# EAGLE design anvil_mainFinal (EAGLE 7.5.0)
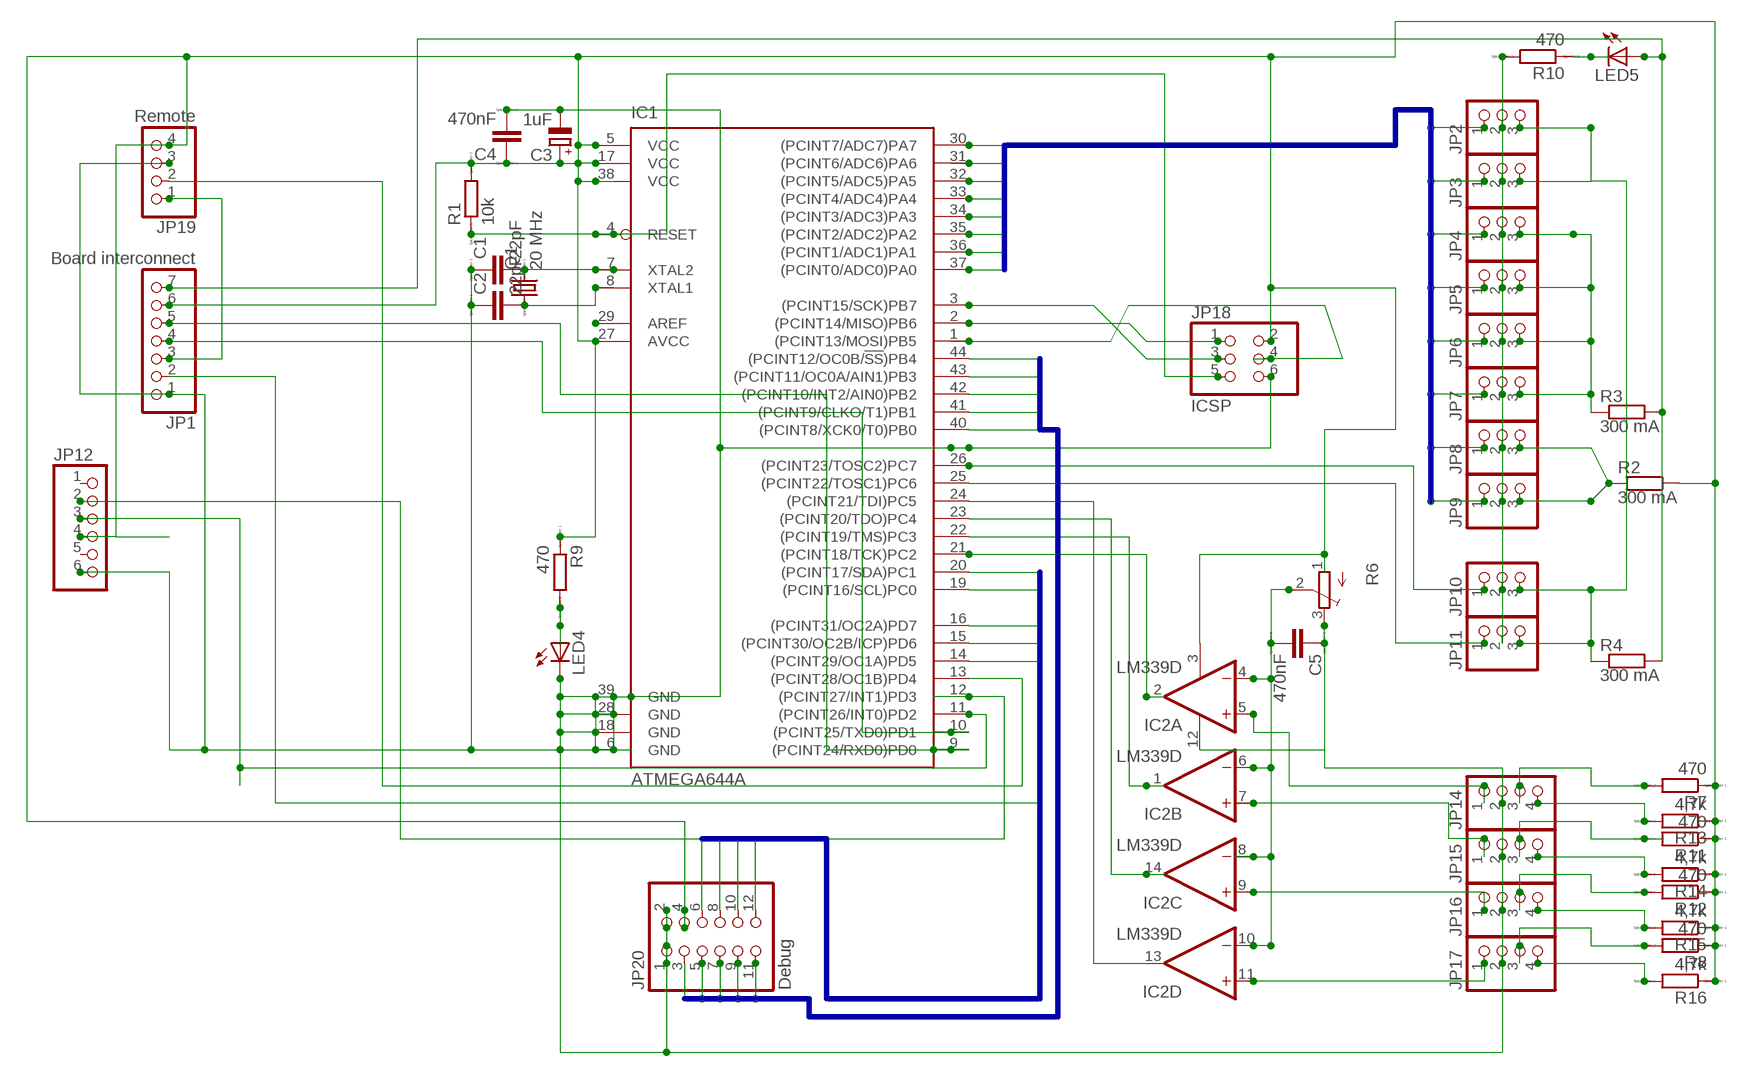
[diagram p0: schematic, sheet 1]

## Parts
C1  22pF  CC1206  [C1206]
C2  22pF  CC1206  [C1206]
C3  1uF  CPOL-EU153CLV-0505  [153CLV-0505]
C4  470nF  CC1206  [C1206]
C5  470nF  CC1206  [C1206]
IC1  ATMEGA644A  [TQFP44]
IC2  LM339D  [SO14]
JP1  Board interconnect  PINHD-1X7_2.54  [1X07]
JP2  PINHD-1X3_2.54-SMD  [1X03SMD]
JP3  PINHD-1X3_2.54-SMD  [1X03SMD]
JP4  PINHD-1X3_2.54-SMD  [1X03SMD]
JP5  PINHD-1X3_2.54-SMD  [1X03SMD]
JP6  PINHD-1X3_2.54-SMD  [1X03SMD]
JP7  PINHD-1X3_2.54-SMD  [1X03SMD]
JP8  PINHD-1X3_2.54-SMD  [1X03SMD]
JP9  PINHD-1X3_2.54-SMD  [1X03SMD]
JP10  PINHD-1X3_2.54-SMD  [1X03SMD]
JP11  PINHD-1X3_2.54-SMD  [1X03SMD]
JP12  PINHD-1X61X06_SMT  [1X06_SMT]
JP14  PINHD-1X4_2.54-SMD  [1X04SMD]
JP15  PINHD-1X4_2.54-SMD  [1X04SMD]
JP16  PINHD-1X4_2.54-SMD  [1X04SMD]
JP17  PINHD-1X4_2.54-SMD  [1X04SMD]
JP18  ICSP  PINHD-2X3_2.54-SMD  [2X03SMD]
JP19  Remote  PINHD-1X4_2.54-SMD  [1X04SMD]
JP20  Debug  PINHD-2X6_2.54-SMD  [2X06SMD]
LED4  LEDSMT1206  [1206]
LED5  LEDSMT1206  [1206]
Q1  20 MHz  CSM-7X-DU  [CSM-7X-DU]
R1  10k  RR1206  [R1206]
R2  300 mA  SMS-REF  [SMS-REF]
R3  300 mA  SMS-REF  [SMS-REF]
R4  300 mA  SMS-REF  [SMS-REF]
R6  TRIM_EU-SM-42/43B  [SM-42/43B]
R7  470  RR1206  [R1206]
R8  470  RR1206  [R1206]
R9  470  RR1206  [R1206]
R10  470  RR1206  [R1206]
R11  470  RR1206  [R1206]
R12  470  RR1206  [R1206]
R13  4,7k  RR1206  [R1206]
R14  4,7k  RR1206  [R1206]
R15  4,7k  RR1206  [R1206]
R16  4,7k  RR1206  [R1206]

## Nets
DBG0: IC1.20((PCINT17/SDA)PC1) JP20.12
DBG1: IC1.19((PCINT16/SCL)PC0) JP20.10
DBG2: IC1.16((PCINT31/OC2A)PD7) JP20.8
DBG3: IC1.15((PCINT30/OC2B/ICP)PD6) JP20.6
DBG4: IC1.44((PCINT12/OC0B/!SS!)PB4) JP20.3
DBG5: IC1.43((PCINT11/OC0A/AIN1)PB3) JP20.5
DBG6: IC1.42((PCINT10/INT2/AIN0)PB2) JP20.7
DBG7: IC1.41((PCINT9/CLKO/T1)PB1) JP20.9
DBG8: IC1.40((PCINT8/XCK0/T0)PB0) JP20.11
GND: C1.1 C2.1 C3.- C4.2 C5.1 IC1.6(GND) IC1.18(GND) IC1.28(GND) IC1.39(GND) IC2.12(P:GND) JP1.1 JP2.2 JP3.2 JP4.2 JP5.2 JP6.2 JP7.2 JP8.2 JP9.2 JP10.2 JP11.2 JP12.6 JP14.2 JP15.2 JP16.2 JP17.2 JP18.6 JP19.3 JP20.1 JP20.2 LED4.C R6.3(E) R10.2
N$1: IC1.11((PCINT26/INT0)PD2) JP12.3
N$2: IC2.11(D:+IN) JP17.1
N$3: C1.2 IC1.7(XTAL2) Q1.2
N$4: C2.2 IC1.8(XTAL1) Q1.1
N$5: JP14.3 R7.2
N$6: IC1.4(RESET) JP18.5 R1.1
N$7: IC2.9(C:+IN) JP16.1
N$8: IC1.24((PCINT21/TDI)PC5) IC2.13(D:OUT)
N$9: IC1.13((PCINT28/OC1B)PD4) JP19.2
N$10: IC1.21((PCINT18/TCK)PC2) IC2.2(A:OUT)
N$11: IC1.12((PCINT27/INT1)PD3) JP12.2
N$13: IC1.22((PCINT19/TMS)PC3) IC2.1(B:OUT)
N$14: IC1.14((PCINT29/OC1A)PD5) JP1.2
N$15: JP8.3 JP9.3 R2.2
N$16: JP1.7 LED5.A R3.1 R4.1
N$23: IC2.7(B:+IN) JP15.1
N$24: IC1.3((PCINT15/SCK)PB7) JP18.3
N$25: IC1.2((PCINT14/MISO)PB6) JP18.1
N$26: IC1.1((PCINT13/MOSI)PB5) JP18.4
N$27: IC2.5(A:+IN) JP14.1
N$28: C5.2 IC2.4(A:-IN) IC2.6(B:-IN) IC2.8(C:-IN) IC2.10(D:-IN) R6.2(S)
N$29: JP14.4 R13.2
N$30: JP15.3 R11.2
N$32: IC1.26((PCINT23/TOSC2)PC7) JP10.1
N$33: IC1.25((PCINT22/TOSC1)PC6) JP11.1
N$35: IC1.23((PCINT20/TDO)PC4) IC2.14(C:OUT)
N$39: JP15.4 R14.2
N$40: JP4.3 JP5.3 JP6.3 JP7.3 R3.2
N$42: JP2.3 JP3.3 JP10.3 JP11.3 R4.2
N$44: C3.+ C4.1 IC1.5(VCC) IC1.17(VCC) IC1.27(AVCC) IC1.38(VCC) IC2.3(P:V+) JP1.6 JP12.4 JP18.2 JP19.4 JP20.4 R1.2 R2.1 R6.1(A) R7.1 R8.1 R9.1 R11.1 R12.1 R13.1 R14.1 R15.1 R16.1
N$45: JP16.3 R12.2
N$46: JP16.4 R15.2
N$47: IC1.10((PCINT25/TXD0)PD1) JP1.4
N$48: IC1.9((PCINT24/RXD0)PD0) JP1.5
N$50: JP17.3 R8.2
N$51: JP17.4 R16.2
N$54: JP1.3 JP19.1
N$56: LED4.A R9.2
N$57: LED5.C R10.1
N$76: IC1.29(AREF)
SNS0: IC1.30((PCINT7/ADC7)PA7) JP2.1
SNS1: IC1.31((PCINT6/ADC6)PA6) JP3.1
SNS2: IC1.32((PCINT5/ADC5)PA5) JP4.1
SNS3: IC1.33((PCINT4/ADC4)PA4) JP5.1
SNS4: IC1.34((PCINT3/ADC3)PA3) JP6.1
SNS5: IC1.35((PCINT2/ADC2)PA2) JP7.1
SNS6: IC1.36((PCINT1/ADC1)PA1) JP8.1
SNS7: IC1.37((PCINT0/ADC0)PA0) JP9.1
Unconnected: JP12.1 JP12.5

## Buses
DBG[0..3]
DBG[4..9]
DBG[4..8]
SNS[0..7]
DBG[0..4]

## Library data of the parts
C1 C2 C4 C5 = eagle-ltspice:C: CAPACITOR, European symbol; SPICEMODEL: NONE; SPICEPREFIX: C
C3 = resistor:CPOL-EU: POLARIZED CAPACITOR, European symbol
IC1 = atmel:ATMEGA644: 8-bit Microcontroller with 64K Bytes In-System Programmable Flash Source: http://www.atmel.com/dyn/resources/prod_documents/doc2593.pdf; MPN: ATMEGA644PV-10AU; OC_FARNELL: 1455123; OC_NEWARK: 58M3748
IC2 = linear:LM339: Low Power Low Offset Voltage Quad Comparators with open collector; LM139/LM239/LM339/LM2901/LM3302
JP1 = pinhead:PINHD-1X7: PIN HEADER
JP2-JP11 = pinhead:PINHD-1X3: PIN HEADER
JP12 = pinhead+:PINHD-1X6: PIN HEADER
JP14-JP17 JP19 = pinhead:PINHD-1X4: PIN HEADER
JP18 = pinhead:PINHD-2X3: PIN HEADER
JP20 = pinhead:PINHD-2X6: PIN HEADER
LED4 LED5 = led:LED: LED OSRAM: - CHIPLED LG R971, LG N971, LY N971, LG Q971, LY Q971, LO R971, LY R971 LH N974, LH R974 LS Q976, LO Q976, LY Q976 LO Q996 - Hyper CHIPLED LW Q18S LB Q993, LB Q99A, LB R99A - SideLED LS A670, LO A670, LY A670, LG A670, LP A670 LB A673, LV A673, LT A673, LW A673 LH A674 LY A675 LS A676, LA A676, LO A676, LY A676, LW A676 LS A679, LY A679, LG A679 - Hyper Micro SIDELED® LS Y876, LA Y876, LO Y876, LY Y876 LT Y87S - SmartLED LW L88C, LW L88S LB L89C, LB L89S, LG L890 LS L89K, LO L89K, LY L89K LS L896, LA L896, LO L896, LY L896 - TOPLED LS T670, LO T670, LY T670, LG T670, LP T670 LSG T670, LSP T670, LSY T670, LOP T670, LYG T670 LG T671, LOG T671, LSG T671 LB T673, LV T673, LT T673, LW T673 LH T674 LS T676, LA T676, LO T676, LY T676, LB T676, LH T676, LSB T676, LW T676 LB T67C, LV T67C, LT T67C, LS T67K, LO T67K, LY T67K, LW E67C LS E67B, LA E67B, LO E67B, LY E67B, LB E67C, LV E67C, LT E67C LW T67C LS T679, LY T679, LG T679 LS T770, LO T770, LY T770, LG T770, LP T770 LB T773, LV T773, LT T773, LW T773 LH T774 LS E675, LA E675, LY E675, LS T675 LS T776, LA T776, LO T776, LY T776, LB T776 LHGB T686 LT T68C, LB T68C - Hyper Mini TOPLED® LB M676 - Mini TOPLED Santana® LG M470 LS M47K, LO M47K, LY M47K Source: http://www.osram.convergy.de LUXEON: - LUMILED® LXK2-PW12-R00, LXK2-PW12-S00, LXK2-PW14-U00, LXK2-PW14-V00 LXK2-PM12-R00, LXK2-PM12-S00, LXK2-PM14-U00 LXK2-PE12-Q00, LXK2-PE12-R00, LXK2-PE12-S00, LXK2-PE14-T00, LXK2-PE14-U00 LXK2-PB12-K00, LXK2-PB12-L00, LXK2-PB12-M00, LXK2-PB14-N00, LXK2-PB14-P00, LXK2-PB14-Q00 LXK2-PR12-L00, LXK2-PR12-M00, LXK2-PR14-Q00, LXK2-PR14-R00 LXK2-PD12-Q00, LXK2-PD12-R00, LXK2-PD12-S00 LXK2-PH12-R00, LXK2-PH12-S00 LXK2-PL12-P00, LXK2-PL12-Q00, LXK2-PL12-R00 Source: www.luxeon.com KINGBRIGHT: KA-3528ASYC Source: www.kingbright.com
Q1 = crystal:CSM-7X-DU: SMD CRYSTAL Source: www.ecsxtal.com .. Crystal 3.6864MHz CSM_7X_DU.PDF; OC_FARNELL: unknown; OC_NEWARK: unknown
R1 R7-R16 = eagle-ltspice:R: RESISTOR, European symbol; SPICEMODEL: NONE; SPICEPREFIX: R
R2-R4 = resistor-shunt:SMS-REF: SMD SHUNT RESISTOR; OC_FARNELL: unknown; OC_NEWARK: unknown
R6 = pot:TRIM_EU-: POTENTIOMETER

## Board
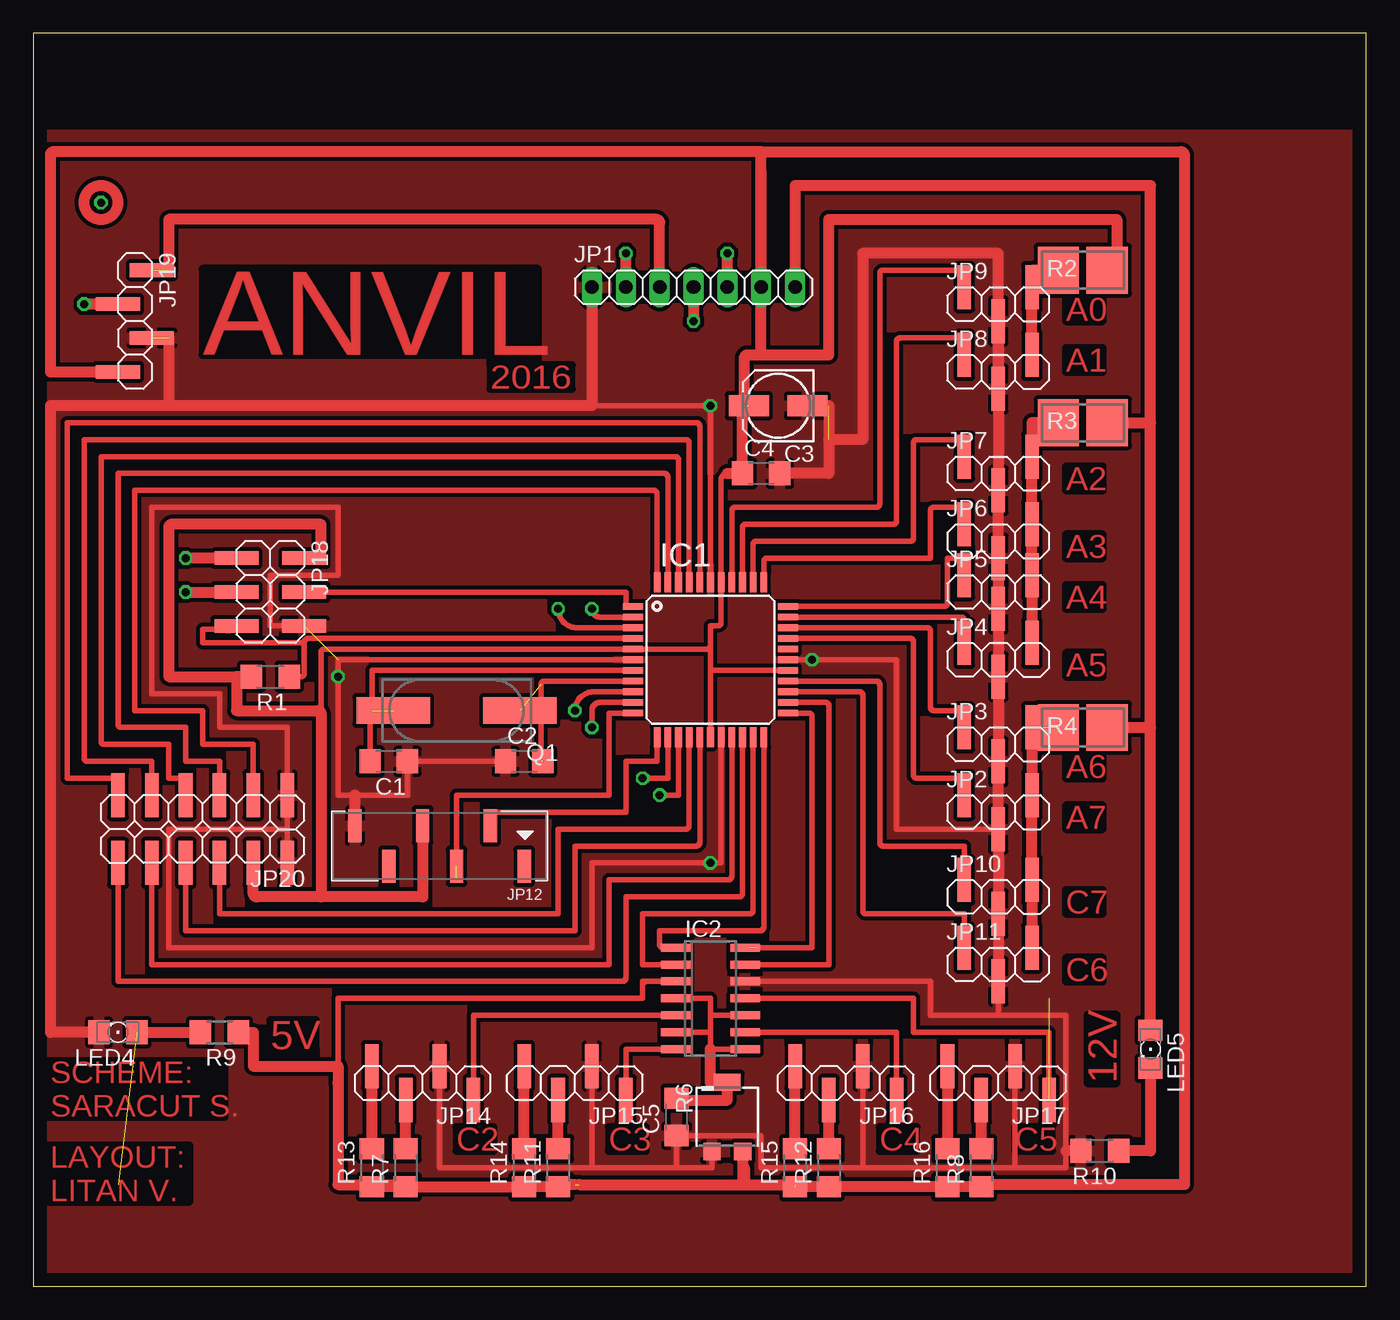
[diagram p1: board, top side]
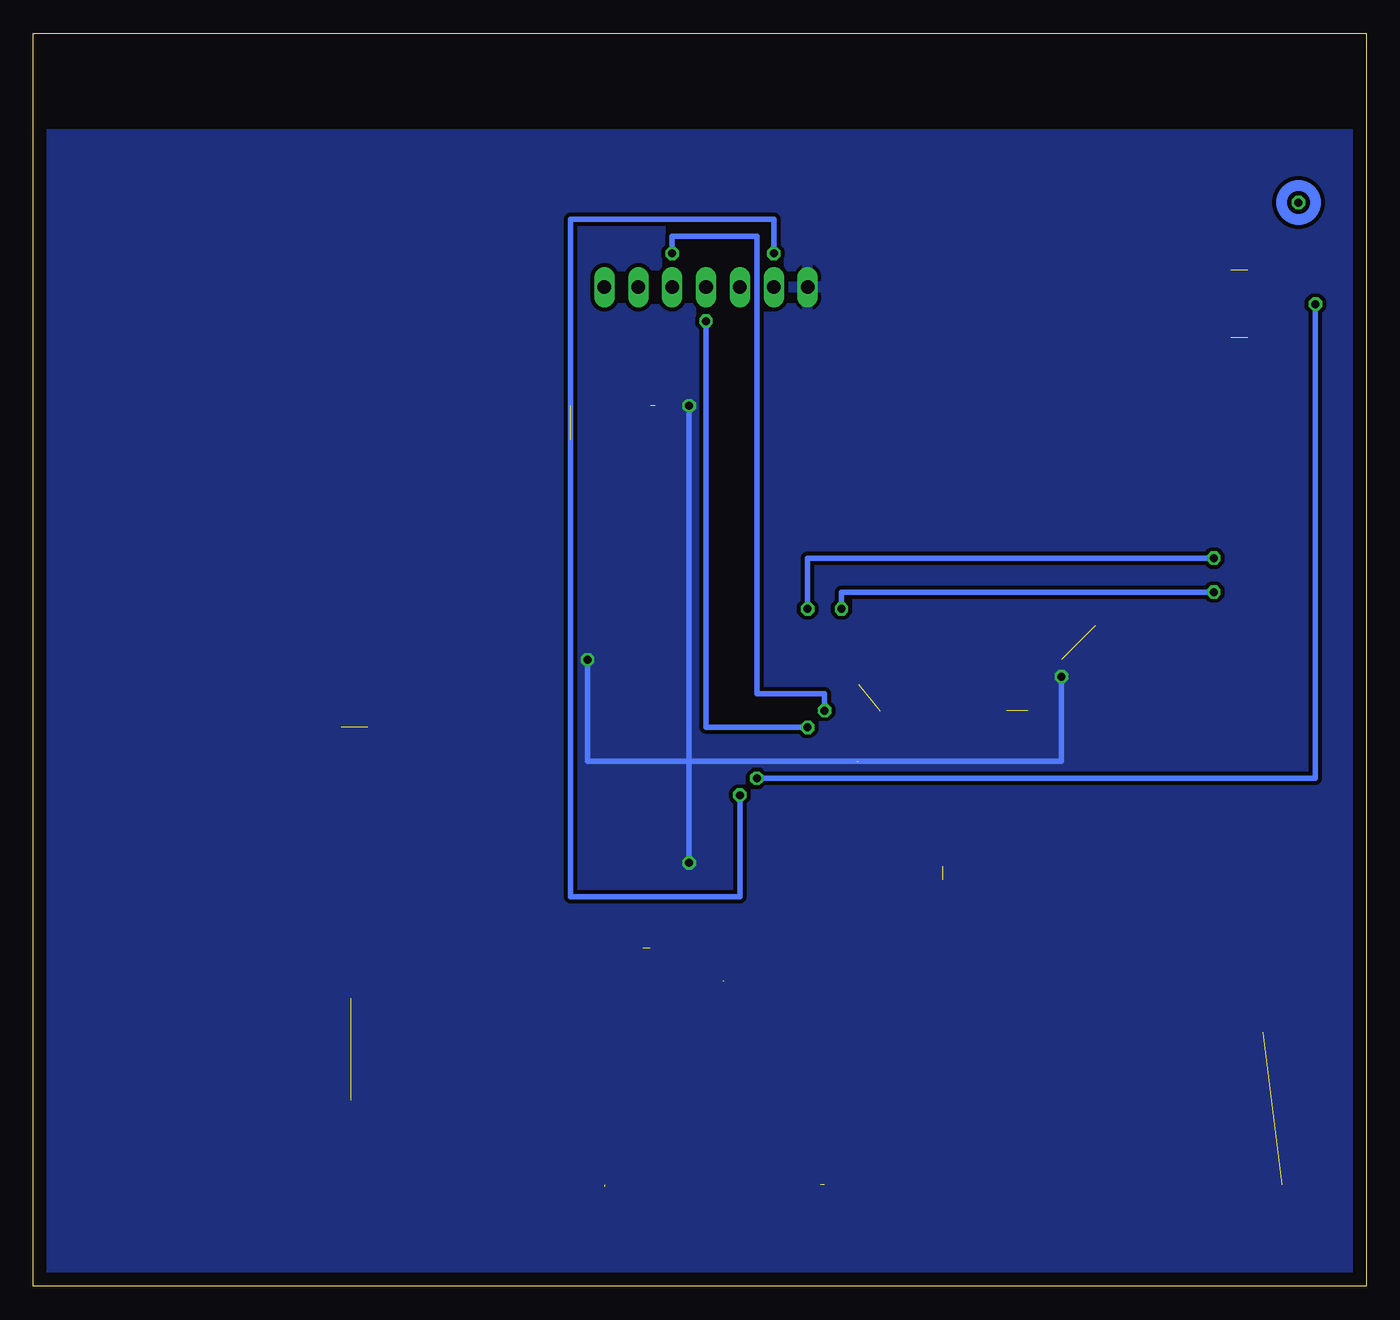
[diagram p2: board, bottom side, seen from below]

Size 100 x 93.97 mm. Coordinates in mm from the lower left corner, seen from the top.
Outline: 0,0 100,0 100,93.97 0,93.97 0,0
Copper layers (1*16): Top 0.035mm / dielectric 1.5mm / Bottom 0.035mm
Design rules "default *": minimum track width 10mil, minimum drill 24mil, track to track 12mil, track to pad 12mil, pad to pad 12mil, via to via 12mil, smd to smd 12mil, copper to edge 40mil, drill to drill 8mil, minimum pad ring 10mil, minimum via ring 8mil, stop-mask expansion 4mil, vias tented up to drill 0mil, thermal gap 10mil

### Footprints (pad centres in the part's own frame; a part is rotated, then mirrored left to right if it is on the bottom)
C1206 = smd 1.6 x 1.8: 1 -1.4,0; 2 1.4,0
153CLV-0505 = smd 3 x 1.6: + 2.2,0; - -2.2,0
TQFP44 = smd 1.5 x 0.5: 1 -5.8,4; 2 -5.8,3.2; 3 -5.8,2.4; 4 -5.8,1.6; 5 -5.8,0.8; 6 -5.8,0; 7 -5.8,-0.8; 8 -5.8,-1.6; 9 -5.8,-2.4; 10 -5.8,-3.2; 11 -5.8,-4; 23 5.8,-4; 24 5.8,-3.2; 25 5.8,-2.4; 26 5.8,-1.6; 27 5.8,-0.8; 28 5.8,0; 29 5.8,0.8; 30 5.8,1.6; 31 5.8,2.4; 32 5.8,3.2; 33 5.8,4 | smd 0.5 x 1.5: 12 -4,-5.8; 13 -3.2,-5.8; 14 -2.4,-5.8; 15 -1.6,-5.8; 16 -0.8,-5.8; 17 0,-5.8; 18 0.8,-5.8; 19 1.6,-5.8; 20 2.4,-5.8; 21 3.2,-5.8; 22 4,-5.8; 34 4,5.8; 35 3.2,5.8; 36 2.4,5.8; 37 1.6,5.8; 38 0.8,5.8; 39 0,5.8; 40 -0.8,5.8; 41 -1.6,5.8; 42 -2.4,5.8; 43 -3.2,5.8; 44 -4,5.8
SO14 = smd 0.6 x 2.2: 1 -3.81,-2.6; 2 -2.54,-2.6; 3 -1.27,-2.6; 4 0,-2.6; 5 1.27,-2.6; 6 2.54,-2.6; 7 3.81,-2.6; 8 3.81,2.6; 9 2.54,2.6; 10 1.27,2.6; 11 0,2.6; 12 -1.27,2.6; 13 -2.54,2.6; 14 -3.81,2.6
1X07 = drill 1.016 long: 1 -7.62,0; 2 -5.08,0; 3 -2.54,0; 4 0,0; 5 2.54,0; 6 5.08,0; 7 7.62,0
1X03SMD = smd 1.016 x 3.302: 1 -1.27,1.27; 2 1.27,-1.27; 3 3.81,1.27
1X06_SMT = smd 1 x 2.5: 1 -6.35,1.52; 2 -3.81,-1.52; 3 -1.27,1.52; 4 1.27,-1.52; 5 3.81,1.52; 6 6.35,-1.52
1X04SMD = smd 1.016 x 3.302: 1 -1.27,1.27; 2 1.27,-1.27; 3 3.81,1.27; 4 6.35,-1.27
2X03SMD = smd 1.016 x 3.302: 1 -1.27,-3.81; 2 -1.27,1.27; 3 1.27,-3.81; 4 1.27,1.27; 5 3.81,-3.81; 6 3.81,1.27
2X06SMD = smd 1.016 x 3.302: 1 -1.27,-3.81; 2 -1.27,1.27; 3 1.27,-3.81; 4 1.27,1.27; 5 3.81,-3.81; 6 3.81,1.27; 7 6.35,-3.81; 8 6.35,1.27; 9 8.89,-3.81; 10 8.89,1.27; 11 11.43,-3.81; 12 11.43,1.27
1206 = smd 1.6 x 1.803: A -1.422,0; C 1.422,0
CSM-7X-DU = smd 5.5 x 2: 1 -4.75,0; 2 4.75,0
R1206 = smd 1.6 x 1.803: 1 -1.422,0; 2 1.422,0
SMS-REF = smd 3.1 x 3.5: 1 1.829,0; 2 -1.829,0
SM-42/43B = smd 1.3 x 1.3: 1 2.6,1.15; 3 2.6,-1.15 | smd 1.3 x 2: 2 -2.6,0

### Placement (x,y rotation side)
C1  26.67,39.37 180 top
C2  36.83,39.37 0 top
C3  55.88,66.04 180 top
C4  54.61,60.96 0 top
C5  48.26,12.7 90 top
IC1  50.8,46.99 0 top
IC2  50.8,21.59 270 top
JP1  49.53,74.93 0 top
JP2  71.12,35.56 0 top
JP3  71.12,40.64 0 top
JP4  71.12,46.99 0 top
JP5  71.12,52.07 0 top
JP6  71.12,55.88 0 top
JP7  71.12,60.96 0 top
JP8  71.12,68.58 0 top
JP9  71.12,73.66 0 top
JP10  71.12,29.21 0 top
JP11  71.12,24.13 0 top
JP12  30.48,33.02 180 top
JP14  31.75,15.24 180 top
JP15  43.18,15.24 180 top
JP16  63.5,15.24 180 top
JP17  74.93,15.24 180 top
JP18  19.05,53.34 270 top
JP19  7.62,74.93 270 top
JP20  17.78,33.02 180 top
LED4  6.35,19.05 180 top
LED5  83.82,17.78 270 top
Q1  31.75,43.18 180 top
R1  17.78,45.72 180 top
R2  78.74,76.2 0 top
R3  78.74,64.77 0 top
R4  78.74,41.91 0 top
R6  52.07,12.7 270 top
R7  27.94,8.89 90 top
R8  71.12,8.89 90 top
R9  13.97,19.05 180 top
R10  80.01,10.16 180 top
R11  39.37,8.89 90 top
R12  59.69,8.89 90 top
R13  25.4,8.89 90 top
R14  36.83,8.89 90 top
R15  57.15,8.89 90 top
R16  68.58,8.89 90 top

### Tracks (layer width: path | path; a pad name or v marks a point on that pad's centre or on a via)
DBG0
  Top 0.406: JP20.12 6.35,22.86 44.2,22.86 arc90 44.45,23.11 44.45,29.21 52.95,29.21 arc90 53.2,29.46 IC1.20
DBG1
  Top 0.406: JP20.10 8.89,24.13 43.18,24.13 43.18,30.48 52.15,30.48 arc90 52.4,30.73 IC1.19
DBG2
  Top 0.406: IC1.16 50,33.27 arc-90 49.75,33.02 40.64,33.02 40.64,26.67 11.43,26.67 11.43,29.21 11.43,30.48 JP20.8
DBG3
  Top 0.406: JP20.6 13.97,27.94 39.37,27.94 39.37,34.29 48.95,34.29 arc90 49.2,34.54 IC1.15
DBG4
  Top 0.406: JP20.3 16.51,40.64 12.7,40.64 12.7,43.18 7.62,43.18 7.62,59.69 46.55,59.69 arc-90 46.8,59.44 IC1.44
DBG5
  Top 0.406: IC1.43 47.6,60.71 arc90 47.35,60.96 6.35,60.96 6.35,42.16 arc90 6.6,41.91 11.43,41.91 11.43,39.37 13.97,39.37 JP20.5
DBG6
  Top 0.406: IC1.42 48.4,61.98 arc90 48.15,62.23 5.08,62.23 5.08,40.89 arc90 5.33,40.64 10.16,40.64 10.16,38.1 11.43,38.1 JP20.7
DBG7
  Top 0.406: IC1.41 49.2,63.25 arc90 48.95,63.5 3.81,63.5 3.81,39.62 arc90 4.06,39.37 8.89,39.37 JP20.9
DBG8
  Top 0.406: 50,64.52 arc90 49.75,64.77 | 49.75,64.77 2.54,64.77 2.54,38.1 6.35,38.1 JP20.11 | 50,64.52 arc90 49.75,64.77 | 50,64.52 IC1.40
GND  (via drill 0.6)  (3 unrouted)
  Top 0.406: 53.34,22.86 IC2.12 67.31,22.86 67.31,20.32 72.39,20.32 | JP20.2 19.05,34.29 | 19.05,34.29 JP20.1 19.05,41.91 13.97,41.91 13.97,44.45 8.89,44.45 8.89,58.42 22.86,58.42 22.86,53.34 17.78,53.34 17.78,49.53 JP18.6 19.05,49.53 | JP14.2 30.48,8.89 41.91,8.89 | 41.91,8.89 48.26,8.89 | 48.26,8.89 50.92,8.89 R6.3 | 48.26,8.89 C5.1 54.61,11.3 54.61,8.89 62.23,8.89 | JP15.2 41.91,8.89 | 73.66,8.89 62.23,8.89 | 62.23,8.89 62.23,15.24 | JP17.2 73.66,8.89 | 73.66,8.89 77.47,8.89 77.47,10.16 77.47,20.32 72.39,20.32 | 44.45,46.99 IC1.6 22.86,46.99 v22.86,45.72 22.86,36.83 24.13,36.83 28.07,36.83 C1.1 C2.1 | IC1.18 51.6,31.75 v50.8,31.75 41.91,31.75 41.91,25.4 10.16,25.4 10.16,34.29 19.05,34.29 | IC1.39 v50.8,66.04 41.91,66.04 | IC1.28 v58.42,46.99 64.77,46.99 64.77,34.29 JP2.2 | JP11.2 72.39,20.32
  Top 0.813: C3.- 59.69,66.04 59.69,60.96 C4.2 | JP1.1 41.91,66.04 10.16,66.04 | 10.16,66.04 1.27,66.04 1.27,19.05 LED4.C | 10.16,71.12 10.16,66.04 | R10.2 77.47,10.16 | 59.69,63.5 62.23,63.5 62.23,77.47 72.39,77.47 JP8.2 | JP9.2 JP8.2 | JP8.2 JP7.2 JP6.2 JP5.2 JP4.2 JP3.2 JP2.2 JP10.2 JP11.2 | 62.23,15.24 JP16.2 | JP12.6 24.13,36.83
  Bottom 0.406: v50.8,66.04 v50.8,31.75 | v22.86,45.72 22.86,39.37 58.42,39.37 v58.42,46.99
  pour Bottom: 0,86.36 100.33,86.36 100.33,0 0,0
  pour Top: 0,86.36 100.33,86.36 100.33,0 0,0
N$1  (1 unrouted)
  Top 0.406: IC1.11 43.18,42.99 43.18,36.83 31.75,36.83 31.75,30.48
N$2  (2 unrouted)
  Top 0.406: IC2.11 66.04,21.59 66.04,19.05 76.2,19.05 76.2,15.24
N$3  (1 unrouted)
  Top 0.406: IC1.7 25.4,46.19 25.4,43.18 25.27,43.18 C1.2
N$4  (2 unrouted)
  Top 0.406: IC1.8 38.35,45.39 arc90 38.1,45.14 38.1,39.37
N$5
  Top 0.813: R7.2 JP14.3
N$6
  Top 0.406: 20.32,48.26 12.7,48.26 12.7,49.28 13.97,49.28 | R1.1 20.07,45.72 arc90 20.32,45.97 20.32,48.26 | 14.22,49.28 arc90 JP18.5 | 13.97,49.28 JP18.5 | 13.97,49.28 arc-90 14.22,49.53 JP18.5 | IC1.4 20.65,48.59 arc90 20.32,48.26
N$7
  Top 0.406: IC2.9 64.77,19.05 JP16.1
N$8
  Top 0.406: IC1.24 59.44,43.79 arc-90 59.69,43.54 59.69,24.13 IC2.13
N$9  (via drill 0.6)
  Top 0.406: 47.6,38.71 IC1.13 47.6,38.1 v45.72,38.1
  Top 0.813: JP19.2 v3.81,73.66
  Bottom 0.406: v3.81,73.66 3.81,38.1 v45.72,38.1
N$10
  Top 0.406: IC2.2 45.72,24.13 45.72,27.94 53.75,27.94 arc90 54,28.19 IC1.21
N$11
  Top 0.406: IC1.12 46.8,39.37 44.45,39.37 44.45,35.56 34.29,35.56 JP12.2
N$12  (via drill 0.6)
  other vias: 5.08,81.28
N$13
  Top 0.406: IC2.1 47.24,25.4 arc-90 46.99,25.65 46.99,26.67 54.55,26.67 arc90 54.8,26.92 IC1.22
N$14  (via drill 0.6)
  Top 0.406: IC1.14 48.4,36.83 v46.99,36.83
  Top 0.813: JP1.2 v44.45,77.47
  Bottom 0.406: v44.45,77.47 44.45,80.01 59.69,80.01 59.69,29.21 46.99,29.21 v46.99,36.83
N$15
  Top 0.813: JP8.3 JP9.3 74.93,76.2 R2.2
N$16
  Top 0.813: LED5.A 83.82,41.91 | 83.82,41.91 83.82,64.77 | 83.82,64.77 83.82,82.55 57.15,82.55 JP1.7 | R3.1 83.82,64.77 | R4.1 83.82,41.91
N$18
  Top 0.813: 52.07,60.96 53.34,60.96
N$23
  Top 0.406: IC2.7 44.45,17.78 JP15.1
N$24  (via drill 0.6)
  Top 0.406: IC1.3 40.78,49.39 arc-90 v39.37,50.8
  Top 0.813: v11.43,52.07 13.97,52.07 JP18.3 16.51,52.07
  Bottom 0.406: v39.37,50.8 39.37,52.07 v11.43,52.07
N$25  (via drill 0.6)
  Top 0.406: IC1.2 42.52,50.19 arc-90 v41.91,50.8
  Top 0.813: JP18.1 v11.43,54.61
  Bottom 0.406: v11.43,54.61 41.91,54.61 v41.91,50.8
N$26
  Top 0.406: IC1.1 44.45,50.99 44.45,52.07 JP18.4
N$27
  Top 0.406: IC2.5 33.02,20.32 JP14.1
N$28
  Top 0.406: IC2.4 50.8,21.59 50.8,20.32 | 50.8,20.32 IC2.10 | IC2.6 50.8,19.05 | 50.8,19.05 50.8,20.32 | IC2.8 50.8,17.78 50.8,19.05
  Top 0.813: C5.2 arc90 48.39,13.97 52.07,13.97 R6.2 50.8,15.3 50.8,17.78
N$29
  Top 0.813: R13.2 JP14.4
N$30
  Top 0.813: R11.2 JP15.3
N$32
  Top 0.406: IC1.26 63.25,45.39 arc-90 63.5,45.14 63.5,33.27 arc90 63.75,33.02 69.85,33.02 JP10.1
N$33
  Top 0.406: IC1.25 61.98,44.59 arc-90 62.23,44.34 62.23,28.19 arc90 62.48,27.94 69.85,27.94 69.85,26.67
  Top 0.813: 69.85,26.67 JP11.1
N$35  (1 unrouted)
  Top 0.406: 53.75,25.4 IC2.14 | IC1.23 58.17,42.99 arc-90 58.42,42.74 58.42,25.4 54.25,25.4
N$39
  Top 0.813: R14.2 JP15.4
N$40
  Top 0.813: JP4.3 JP5.3 JP6.3 JP7.3 74.93,64.77 R3.2
N$42  (1 unrouted)
  Top 0.813: JP11.3 JP10.3 JP2.3 JP3.3
N$44  (4 unrouted)
  Top 0.406: IC1.17 50.8,46.44 | 50.8,46.99 50.8,46.44 | 50.8,46.44 arc90 51.05,46.19 IC1.27 | IC1.17 50.8,47.54 arc90 50.55,47.79 | IC1.17 50.8,48.04 | 50.8,48.04 50.8,49.28 | 50.8,49.28 arc-90 51.05,49.53 | 50.8,49.28 50.8,49.53 51.35,49.53 arc90 51.6,49.78 IC1.38 51.6,60.62 arc-90 C4.1 | 48.26,22.86 45.97,22.86 | 45.97,22.86 arc90 45.72,22.61 | 45.72,22.61 45.72,21.59 22.86,21.59 22.86,15.24 | 21.34,43.18 21.59,43.18 21.59,47.54 arc-90 21.84,47.79 IC1.5 50.55,47.79 | 50.55,47.79 arc90 50.8,48.04 | 45.97,22.86 45.72,22.86 45.72,22.61
  Top 0.813: 54.61,76.2 JP1.6 | JP1.6 54.61,85.09 | 54.61,85.09 86.11,85.09 arc-90 86.36,84.84 86.36,7.62 71.27,7.62 arc90 R8.1 R16.1 R12.1 R15.1 | R7.1 R13.1 | 40.64,7.62 39.52,7.62 arc90 R11.1 R14.1 R7.1 | 40.94,7.62 53.34,7.62 | 53.34,7.62 57.15,7.62 | R6.1 53.22,7.74 arc90 53.34,7.62 | 53.28,8.89 53.34,8.89 53.34,7.62 | C4.1 53.21,65.91 arc-90 53.34,66.04 53.34,69.6 arc-90 53.59,69.85 54.61,69.85 | 54.61,69.85 JP1.6 | R7.1 arc90 27.79,7.62 22.86,7.62 22.86,15.24 22.86,16.51 16.51,16.51 16.51,19.05 R9.1 | 54.61,85.09 1.52,85.09 arc90 1.27,84.84 1.27,68.58 JP19.4 | R1.2 15.49,45.72 arc90 15.24,45.47 | 15.24,45.47 15.24,43.18 21.34,43.18 arc-90 21.59,42.93 21.59,29.21 | 21.59,29.21 16.76,29.21 | 16.76,29.21 arc-90 16.51,29.46 | 21.59,29.21 29.21,29.21 JP12.4 | 16.76,29.21 arc-90 16.51,29.46 | 16.51,29.46 JP20.4 | JP18.2 21.34,54.61 arc90 21.59,54.86 21.59,57.15 10.41,57.15 arc90 10.16,56.9 10.16,45.72 15.24,45.72 15.24,45.47 | 54.61,83.57 JP1.6 | 54.61,69.85 59.69,69.85 59.69,80.01 81.28,80.01 81.28,76.2 R2.1
N$45
  Top 0.813: R12.2 JP16.3 59.69,15.24
N$46
  Top 0.813: R15.2 JP16.4
N$47  (via drill 0.6)
  Top 0.406: IC1.10 42.52,43.79 arc90 41.91,43.18 v41.91,41.91
  Top 0.813: JP1.4 v49.53,72.39
  Bottom 0.406: v49.53,72.39 49.53,41.91 v41.91,41.91
N$48  (via drill 0.6)
  Top 0.406: IC1.9 42.05,44.59 arc90 v40.64,43.18
  Top 0.813: JP1.5 v52.07,77.47
  Bottom 0.406: v52.07,77.47 52.07,78.74 45.72,78.74 45.72,44.45 40.64,44.45 v40.64,43.18
N$50
  Top 0.813: R8.2 JP17.3 71.12,15.24
N$51
  Top 0.813: JP17.4 R16.2
N$54  (1 unrouted)
  Top 0.813: JP1.3 46.99,79.76 arc90 46.74,80.01 10.16,80.01 10.16,76.2
N$56  (1 unrouted)
  Top 0.813: LED4.A R9.2
N$57
  Top 0.813: LED5.C 83.82,10.16 R10.1
SNS0
  Top 0.406: IC1.30 65.79,48.59 arc-90 66.04,48.34 66.04,38.35 arc90 66.29,38.1 69.85,38.1 JP2.1
SNS1
  Top 0.406: JP3.1 69.85,42.93 arc90 69.6,43.18 67.56,43.18 arc-90 67.31,43.43 67.31,49.14 arc90 67.06,49.39 IC1.31
SNS2
  Top 0.406: IC1.32 69.6,50.19 arc-90 69.85,49.94 69.85,49.53
  Top 0.813: JP4.1 69.85,49.53
SNS3
  Top 0.406: IC1.33 68.33,50.99 arc90 68.58,51.24 68.58,54.61 69.85,54.61
  Top 0.813: JP5.1 69.85,54.61
SNS4
  Top 0.406: 69.85,58.42 67.56,58.42 arc90 67.31,58.17 67.31,54.61 55.05,54.61 arc90 54.8,54.36 IC1.34
  Top 0.813: JP6.1 69.85,58.42
SNS5
  Top 0.406: 69.85,63.5 66.29,63.5 arc90 66.04,63.25 66.04,56.13 arc-90 65.79,55.88 54.25,55.88 arc90 54,55.63 IC1.35
  Top 0.813: JP7.1 69.85,63.5
SNS6
  Top 0.406: 69.85,71.12 65.02,71.12 arc90 64.77,70.87 64.77,57.4 arc-90 64.52,57.15 53.45,57.15 arc90 53.2,56.9 IC1.36
  Top 0.813: JP8.1 69.85,71.12
SNS7
  Top 0.406: 69.85,76.2 63.75,76.2 arc90 63.5,75.95 63.5,58.67 arc-90 63.25,58.42 52.65,58.42 arc90 52.4,58.17 IC1.37
  Top 0.813: 69.85,76.2 JP9.1
(copper drawn outside any net)
  shapes: Bottom circle x1, Top circle x1

### Text on the board
Top: A0 | ANVIL | A1 | 2016 | A2 | A3 | A4 | A5 | A6 | A7 | C7 | C6 | 5V | 12V | SCHEME: / SARACUT S. | C2 | C3 | C4 | C5 | LAYOUT: / LITAN V.